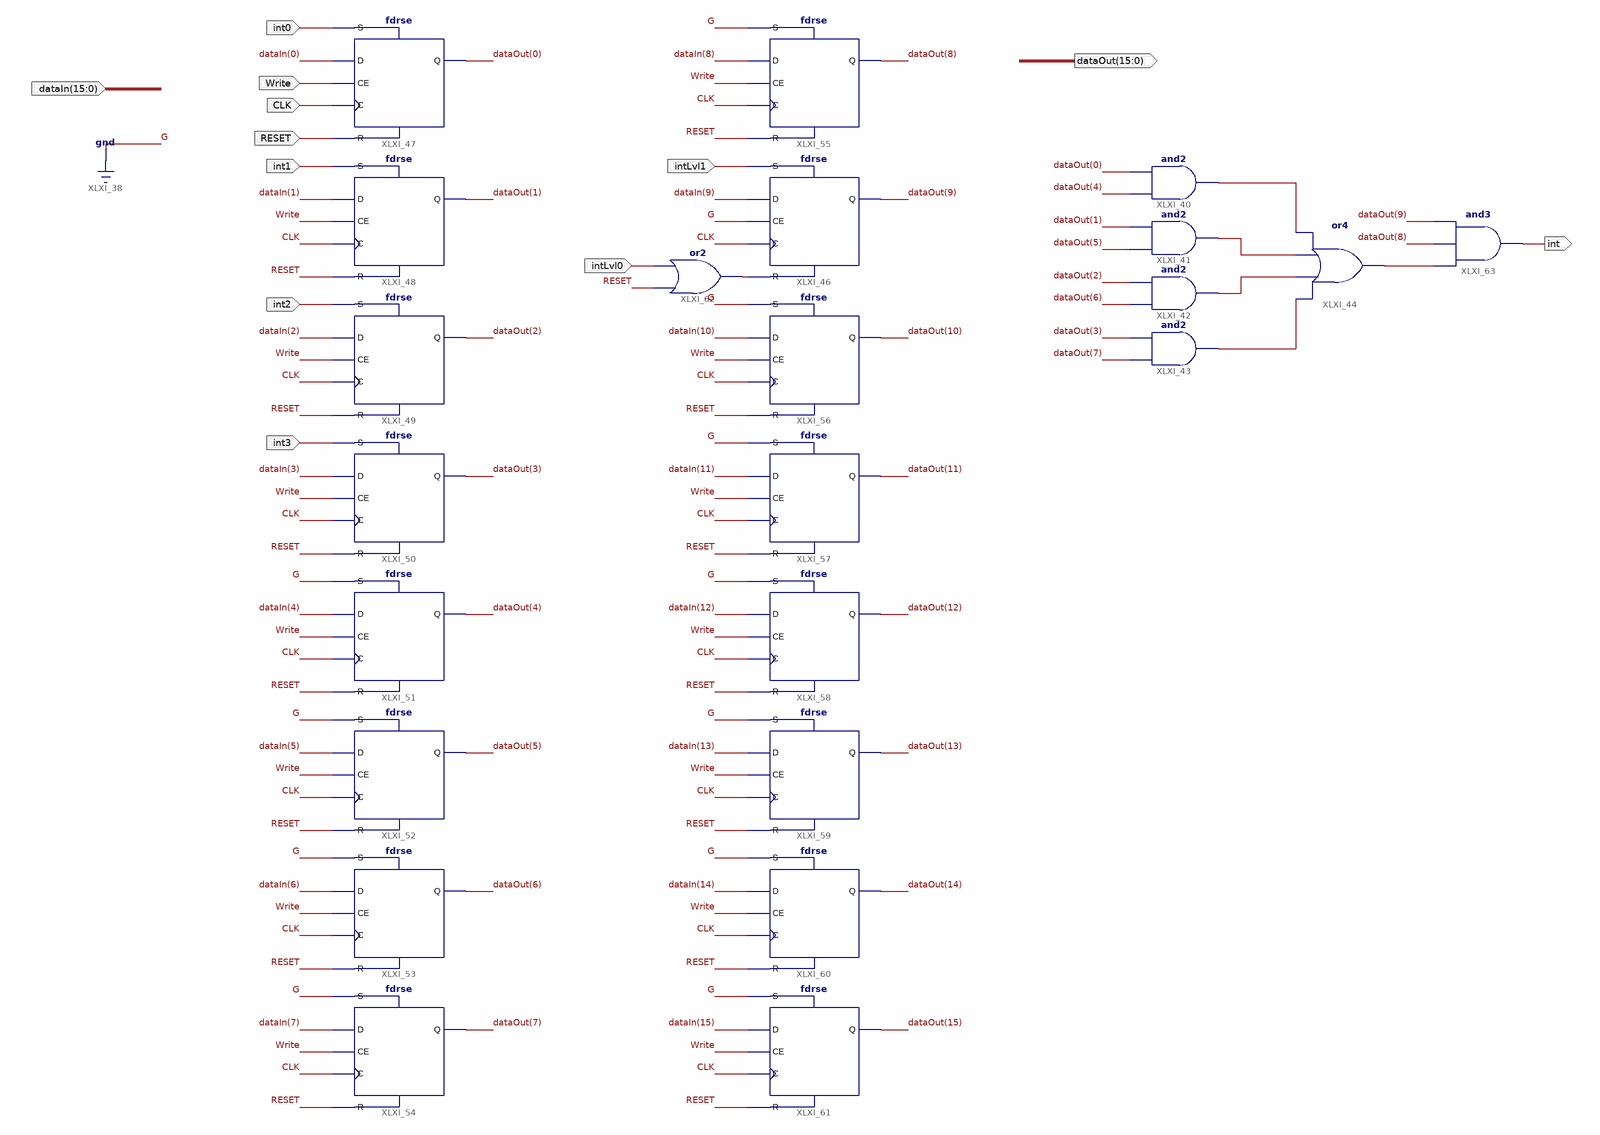
[diagram p0: schematic sheet 1]
// Xilinx ISE schematic intReg16.sch (spartan3e) as structural Verilog: 23 symbols, 12 ports
module intReg16 (
  input  Write,
  input  CLK,
  input  int0,
  input  int1,
  input  int2,
  input  int3,
  input  [15:0] dataIn,
  input  intLvl1,
  input  RESET,
  input  intLvl0,
  output [15:0] dataOut,
  output \int 
);

  wire XLXN_170, XLXN_179, XLXN_181, XLXN_182, XLXN_184, XLXN_204;

  and XLXI_40 (XLXN_170, dataOut[4], dataOut[0]);
  and XLXI_41 (XLXN_181, dataOut[5], dataOut[1]);
  and XLXI_42 (XLXN_182, dataOut[6], dataOut[2]);
  and XLXI_43 (XLXN_179, dataOut[7], dataOut[3]);
  or XLXI_44 (XLXN_184, XLXN_179, XLXN_182, XLXN_181, XLXN_170);
  fdrse XLXI_46 (.C(CLK), .CE(1'b0), .D(dataIn[9]), .R(XLXN_204), .S(intLvl1), .Q(dataOut[9]));
  fdrse XLXI_47 (.C(CLK), .CE(Write), .D(dataIn[0]), .R(RESET), .S(int0), .Q(dataOut[0]));
  fdrse XLXI_48 (.C(CLK), .CE(Write), .D(dataIn[1]), .R(RESET), .S(int1), .Q(dataOut[1]));
  fdrse XLXI_49 (.C(CLK), .CE(Write), .D(dataIn[2]), .R(RESET), .S(int2), .Q(dataOut[2]));
  fdrse XLXI_50 (.C(CLK), .CE(Write), .D(dataIn[3]), .R(RESET), .S(int3), .Q(dataOut[3]));
  fdrse XLXI_51 (.C(CLK), .CE(Write), .D(dataIn[4]), .R(RESET), .S(1'b0), .Q(dataOut[4]));
  fdrse XLXI_52 (.C(CLK), .CE(Write), .D(dataIn[5]), .R(RESET), .S(1'b0), .Q(dataOut[5]));
  fdrse XLXI_53 (.C(CLK), .CE(Write), .D(dataIn[6]), .R(RESET), .S(1'b0), .Q(dataOut[6]));
  fdrse XLXI_54 (.C(CLK), .CE(Write), .D(dataIn[7]), .R(RESET), .S(1'b0), .Q(dataOut[7]));
  fdrse XLXI_55 (.C(CLK), .CE(Write), .D(dataIn[8]), .R(RESET), .S(1'b0), .Q(dataOut[8]));
  fdrse XLXI_56 (.C(CLK), .CE(Write), .D(dataIn[10]), .R(RESET), .S(1'b0), .Q(dataOut[10]));
  fdrse XLXI_57 (.C(CLK), .CE(Write), .D(dataIn[11]), .R(RESET), .S(1'b0), .Q(dataOut[11]));
  fdrse XLXI_58 (.C(CLK), .CE(Write), .D(dataIn[12]), .R(RESET), .S(1'b0), .Q(dataOut[12]));
  fdrse XLXI_59 (.C(CLK), .CE(Write), .D(dataIn[13]), .R(RESET), .S(1'b0), .Q(dataOut[13]));
  fdrse XLXI_60 (.C(CLK), .CE(Write), .D(dataIn[14]), .R(RESET), .S(1'b0), .Q(dataOut[14]));
  fdrse XLXI_61 (.C(CLK), .CE(Write), .D(dataIn[15]), .R(RESET), .S(1'b0), .Q(dataOut[15]));
  or XLXI_62 (XLXN_204, RESET, intLvl0);
  and XLXI_63 (\int , XLXN_184, dataOut[8], dataOut[9]);
endmodule
